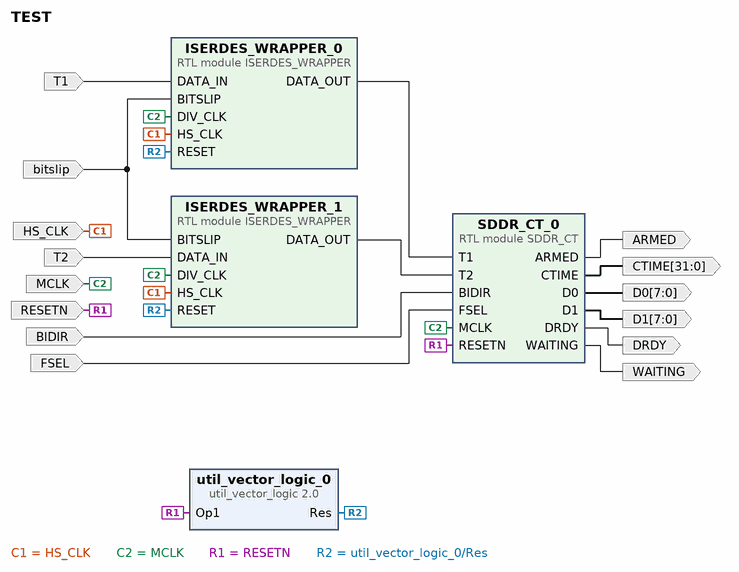
[diagram p0: block diagram of the top level]
# Vivado block design TEST, xc7z020clg400-1, Vivado 2019.1
create_bd_design TEST

create_bd_port -dir I T1
create_bd_port -dir I T2
create_bd_port -dir I -type clk HS_CLK
set_property -dict {CONFIG.FREQ_HZ 800000000} [get_bd_ports HS_CLK]
create_bd_port -dir I -type clk MCLK
set_property -dict {CONFIG.FREQ_HZ 400000000} [get_bd_ports MCLK]
create_bd_port -dir I -type rst RESETN
create_bd_port -dir I bitslip
create_bd_port -dir I FSEL
create_bd_port -dir I BIDIR
create_bd_port -dir O -from 7 -to 0 D0
create_bd_port -dir O -from 7 -to 0 D1
create_bd_port -dir O DRDY
create_bd_port -dir O -from 31 -to 0 CTIME
create_bd_port -dir O WAITING
create_bd_port -dir O ARMED

create_bd_cell -type ip -vlnv xilinx.com:ip:util_vector_logic:2.0 util_vector_logic_0
set_property -dict {CONFIG.C_OPERATION not CONFIG.C_SIZE 1} [get_bd_cells util_vector_logic_0]
create_bd_cell -type module -reference ISERDES_WRAPPER ISERDES_WRAPPER_0
create_bd_cell -type module -reference ISERDES_WRAPPER ISERDES_WRAPPER_1
create_bd_cell -type module -reference SDDR_CT SDDR_CT_0
set_property -dict {CONFIG.SIG_WIDTH 4} [get_bd_cells SDDR_CT_0]

# ---- connections ----

connect_bd_net -net T1_1 [get_bd_ports T1] [get_bd_pins ISERDES_WRAPPER_0/DATA_IN]
connect_bd_net -net T2_1 [get_bd_ports T2] [get_bd_pins ISERDES_WRAPPER_1/DATA_IN]
connect_bd_net [get_bd_ports HS_CLK] [get_bd_pins ISERDES_WRAPPER_0/HS_CLK] [get_bd_pins ISERDES_WRAPPER_1/HS_CLK]
connect_bd_net [get_bd_ports MCLK] [get_bd_pins ISERDES_WRAPPER_0/DIV_CLK] [get_bd_pins ISERDES_WRAPPER_1/DIV_CLK] [get_bd_pins SDDR_CT_0/MCLK]
connect_bd_net [get_bd_ports RESETN] [get_bd_pins util_vector_logic_0/Op1] [get_bd_pins SDDR_CT_0/RESETN]
connect_bd_net [get_bd_pins util_vector_logic_0/Res] [get_bd_pins ISERDES_WRAPPER_0/RESET] [get_bd_pins ISERDES_WRAPPER_1/RESET]
connect_bd_net [get_bd_ports bitslip] [get_bd_pins ISERDES_WRAPPER_0/BITSLIP] [get_bd_pins ISERDES_WRAPPER_1/BITSLIP]
connect_bd_net [get_bd_pins SDDR_CT_0/D0] [get_bd_ports D0]
connect_bd_net [get_bd_ports BIDIR] [get_bd_pins SDDR_CT_0/BIDIR]
connect_bd_net [get_bd_pins SDDR_CT_0/CTIME] [get_bd_ports CTIME]
connect_bd_net [get_bd_pins SDDR_CT_0/WAITING] [get_bd_ports WAITING]
connect_bd_net [get_bd_pins SDDR_CT_0/D1] [get_bd_ports D1]
connect_bd_net [get_bd_ports FSEL] [get_bd_pins SDDR_CT_0/FSEL]
connect_bd_net [get_bd_pins SDDR_CT_0/ARMED] [get_bd_ports ARMED]
connect_bd_net [get_bd_pins SDDR_CT_0/DRDY] [get_bd_ports DRDY]
connect_bd_net [get_bd_pins ISERDES_WRAPPER_0/DATA_OUT] [get_bd_pins SDDR_CT_0/T1]
connect_bd_net [get_bd_pins ISERDES_WRAPPER_1/DATA_OUT] [get_bd_pins SDDR_CT_0/T2]

validate_bd_design
save_bd_design
